# EasyEDA Pro project SKY13575-639LF射频开关1to4.eprj

# Schematic Schematic1
Board Name: Board1; Create Date: 2025-12-01; Page Name: P1; Project Name: SKY13575-639LF射频开关1to4; Schematic Name: Schematic1; Update Date: 2025-12-01; Company: 嘉立创EDA; Page Size: A4; Version: V1.0
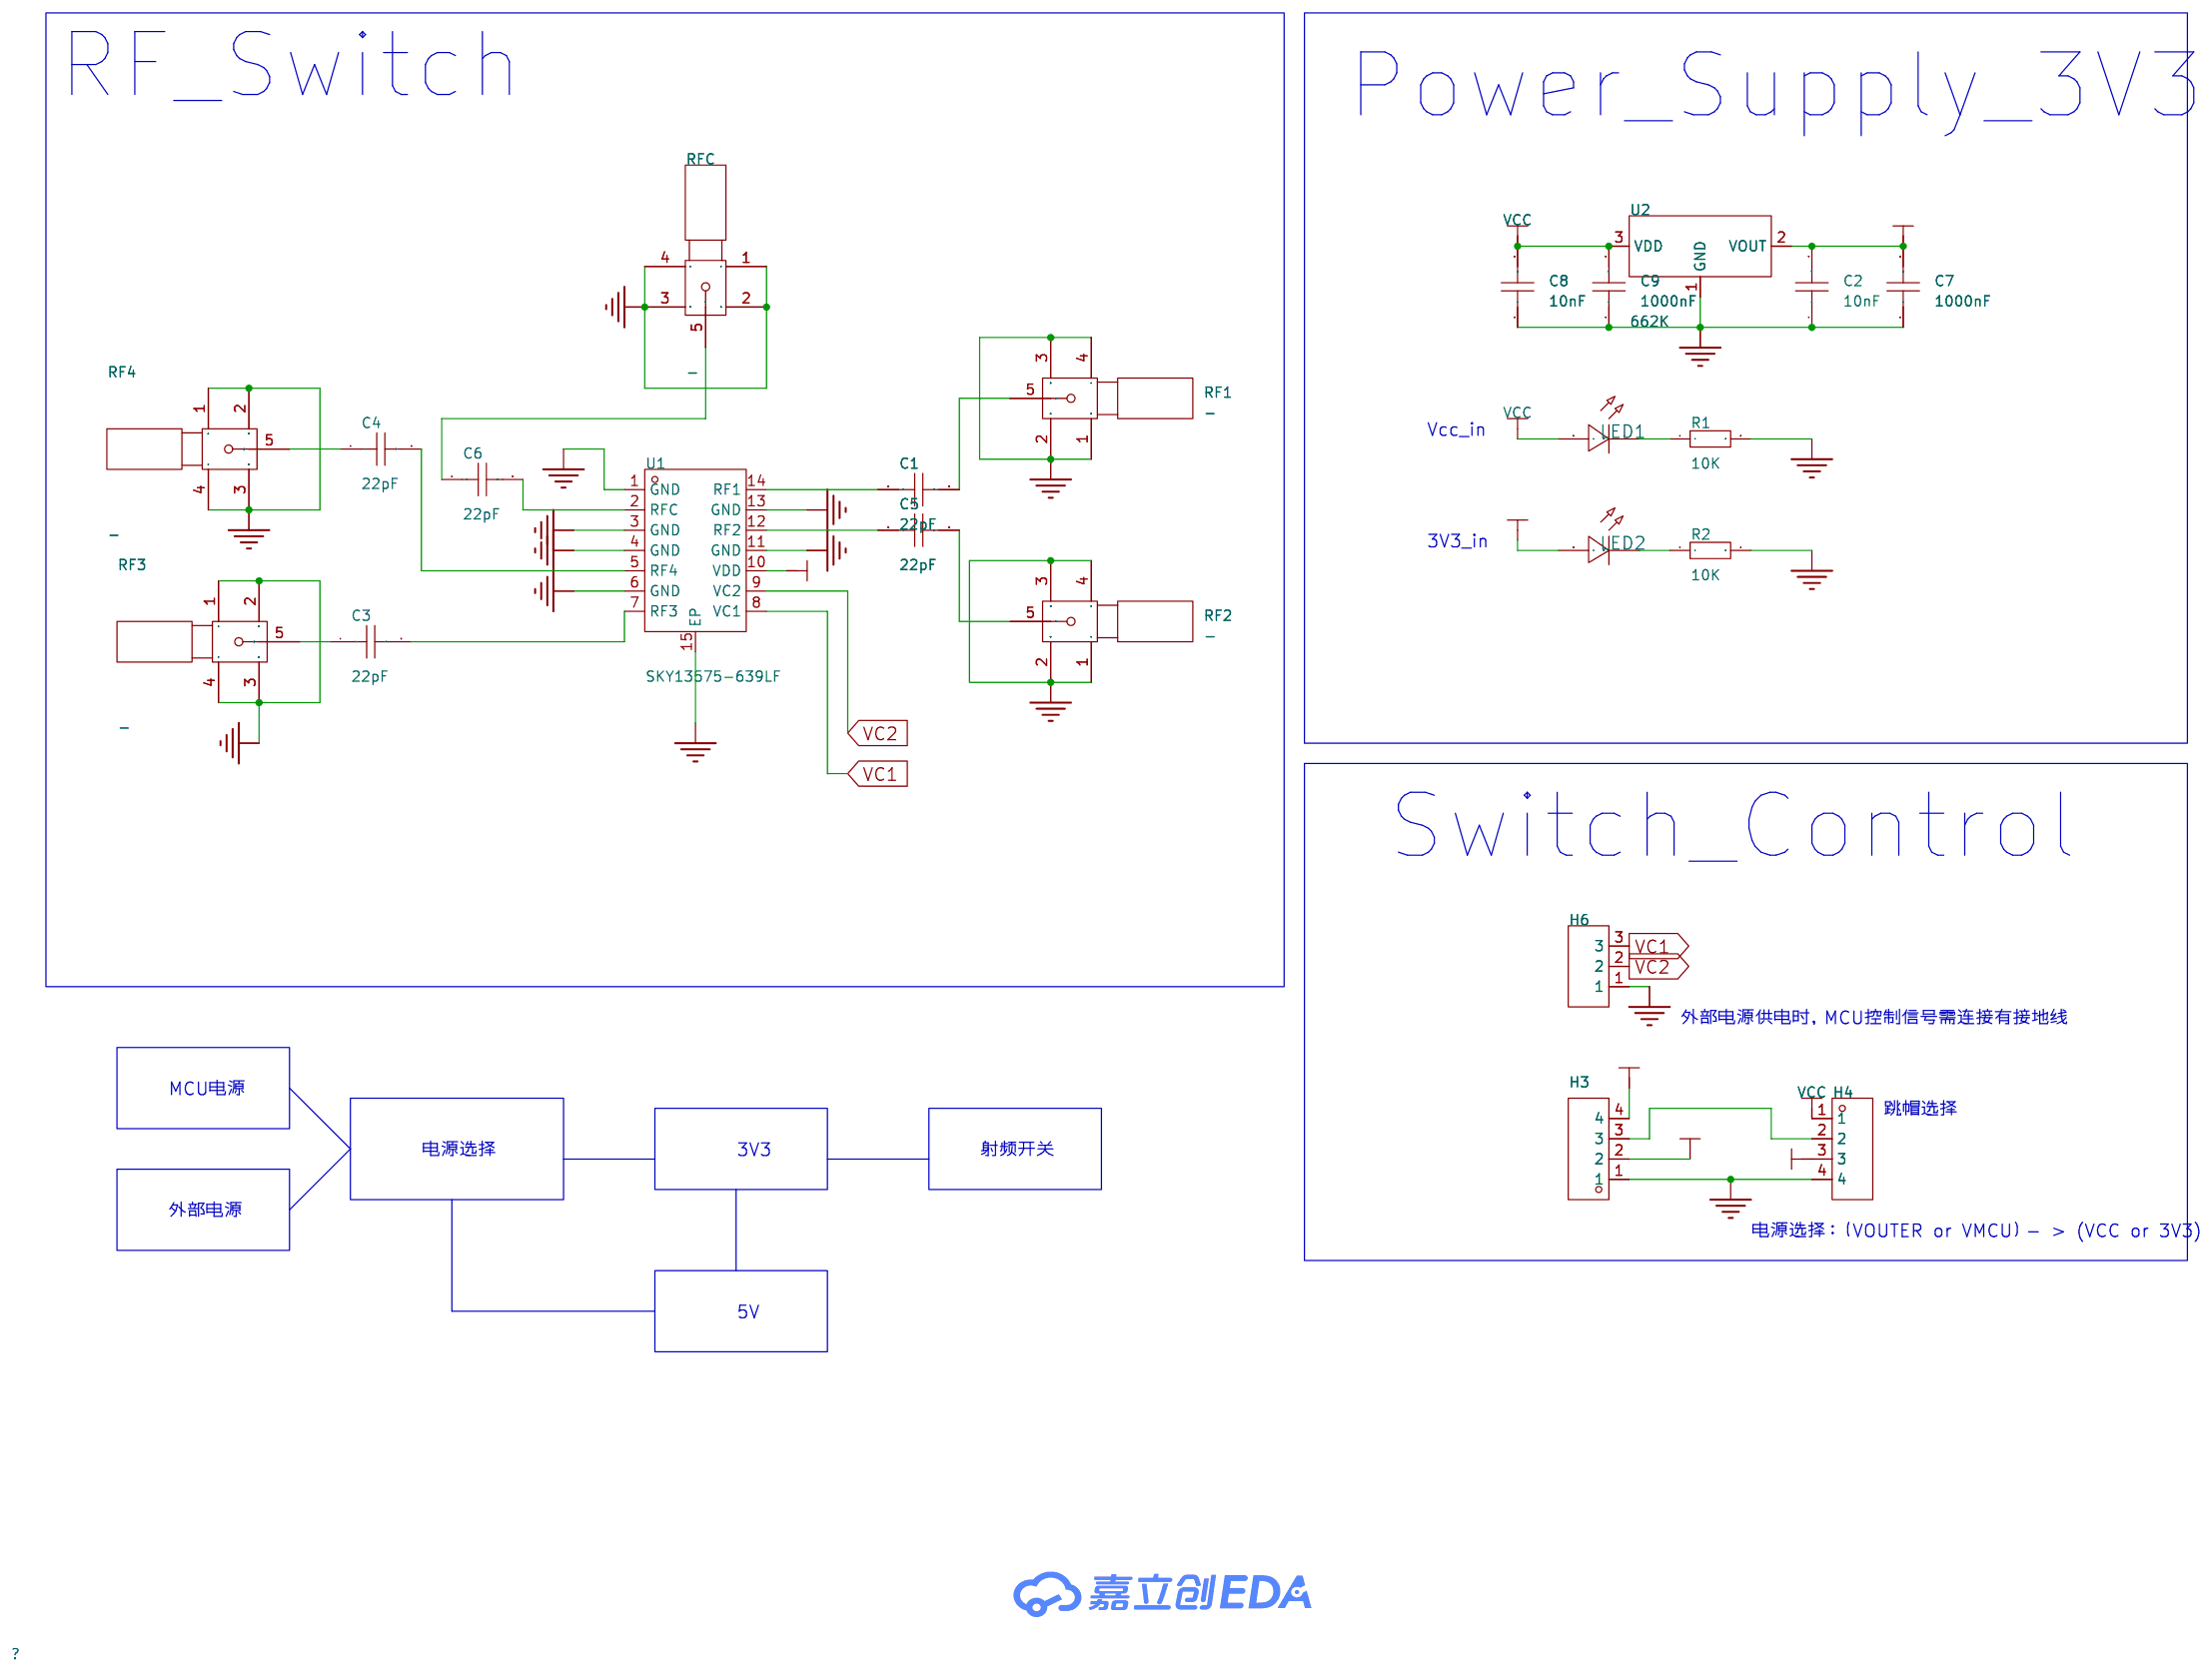
[diagram p0: schematic sheet]

## Parts
C1  22pF  [C0603]
C2  10nF  [C0603]
C3  22pF  [C0603]
C4  22pF  [C0603]
C5  22pF  [C0603]
C6  22pF  [C0603]
C7  1000nF  [C0603]
C8  10nF  [C0603]
C9  1000nF  [C0603]
H3  -  [HDR-TH_4P-P2.54-V-F]
H4  -  [HDR-TH_4P-P2.54-V-F]
H6  -  [HDR-TH_3P-P2.54-V-F]
LED1  -  [LED_0603]
LED2  -  [LED_0603]
R1  10K  [R0603]
R2  10K  [R0603]
RF1  -  [SMA-SMD_BWSMA-KE-P001]
RF2  -  [SMA-SMD_BWSMA-KE-P001]
RF3  -  [SMA-SMD_BWSMA-KE-P001]
RF4  -  [SMA-SMD_BWSMA-KE-P001]
RFC  -  [SMA-SMD_BWSMA-KE-P001]
U1  SKY13575-639LF  [QFN-14_L1.6-W1.6-P0.40-BL-EP0.7]
U2  662K  [SOT-23-3_L2.9-W1.3-P1.90-LS2.4-BR]

## Library data of the parts
C1-C9 = CAP_0603: Supplier Footprint: 0603
H3 H4 = HDR-F_2.54_1x4P: Supplier Part: C2718488; Supplier Footprint: 插件
H6 = HDR-F_2.54_1x3P: Supplier Part: C541850; Supplier Footprint: 插件
LED1 LED2 = LED_0603-R: Supplier Footprint: 0603
R1 R2 = Res_0603: Supplier Footprint: 0603
RF1-RF4 RFC = BWSMA-KE-P001: LCSC Part Name: 内孔 SMA 偏脚; Supplier Part: C496550; Manufacturer: BAT WIRELESS(蝙蝠无线); Supplier Footprint: SMD; JLCPCB Part Class: 扩展库; Datasheet: https://atta.szlcsc.com/upload/public/pdf/source/20240320/28FD502871C976DFF213ABFCF2A0ED51.pdf; Supplier: LCSC; Connector Type: 板端; Interface: 内孔; Number of Ports: 1; Interface Diameter: 5.2mm; RF Series: SMA; Impedance: 50Ω; Style: 偏脚
U1 = SKY13575-639LF: Supplier Part: C2654730; Manufacturer: SKYWORKS; Supplier Footprint: QFN-14-EP(1.6x1.6); JLCPCB Part Class: 扩展库; Datasheet: https://item.szlcsc.com/datasheet/SKY13575-639LF/2746639.html; Supplier: LCSC
U2 = 662K: LCSC Part Name: 662K. 输入8V 300mA; Supplier Part: C7470756; Manufacturer: HXY MOSFET(华轩阳电子); Supplier Footprint: SOT-23; JLCPCB Part Class: 扩展库; Datasheet: https://item.szlcsc.com/datasheet/662K/8523266.html; Supplier: LCSC; Output Type: 固定; Voltage - Supply: 8V; Output Voltage: 3.3V; Output Current: 300mA; Power Supply Rejection Ratio (PSRR): 40dB@(1kHz); Voltage Dropout: 160mV@(50mA); standby current: 3uA; Features: 过流保护; Operating Temperature: -40℃~+85℃; Output Configuration: 正极; Number of Outputs: 1

## Nets
3V3: C2.2 C7.2 H4.3 LED2.2(A) U1.10(VDD) U2.2(VOUT)
GND: C2.1 C7.1 C8.1 C9.1 H3.1 H4.4 H6.1 R1.2 R2.2 RF1.1 RF1.2 RF1.3 RF1.4 RF2.1 RF2.2 RF2.3 RF2.4 RF3.1 RF3.2 RF3.3 RF3.4 RF4.1 RF4.2 RF4.3 RF4.4 RFC.1 RFC.2 RFC.3 RFC.4 U1.1(GND) U1.3(GND) U1.4(GND) U1.6(GND) U1.11(GND) U1.13(GND) U1.15(EP) U2.1(GND)
VCC: C8.2 C9.2 H4.1 LED1.2(A) U2.3(VDD)
VC1: H6.3 U1.8(VC1)
VC2: H6.2 U1.9(VC2)
VMCU: H3.2
VOUTER: H3.4
$1N936: C4.1 RF4.5
$1N951: C5.2 RF2.5
$1N962: C4.2 U1.5(RF4)
$1N970: C6.2 U1.2(RFC)
$1N976: C1.1 U1.14(RF1)
$1N981: C5.1 U1.12(RF2)
$1N986: C3.1 RF3.5
$1N1095: C1.2 RF1.5
$1N2051: H3.3 H4.2
$1N2530: C3.2 U1.7(RF3)
$1N2570: C6.1 RFC.5
Net-(LED1-1): LED1.1(C) R1.1
Net-(LED2-1): LED2.1(C) R2.1

## Notes on the sheet
- RF_Switch
- Power_Supply_3V3
- Vcc_in
- 3V3_in
- Switch_Control
- 外部电源供电时，MCU控制信号需连接有接地线
- MCU电源
- 跳帽选择
- 电源选择
- 3V3
- 射频开关
- 外部电源
- 电源选择：（VOUTER or VMCU）- > (VCC or 3V3)
- 5V

# Board PCB1
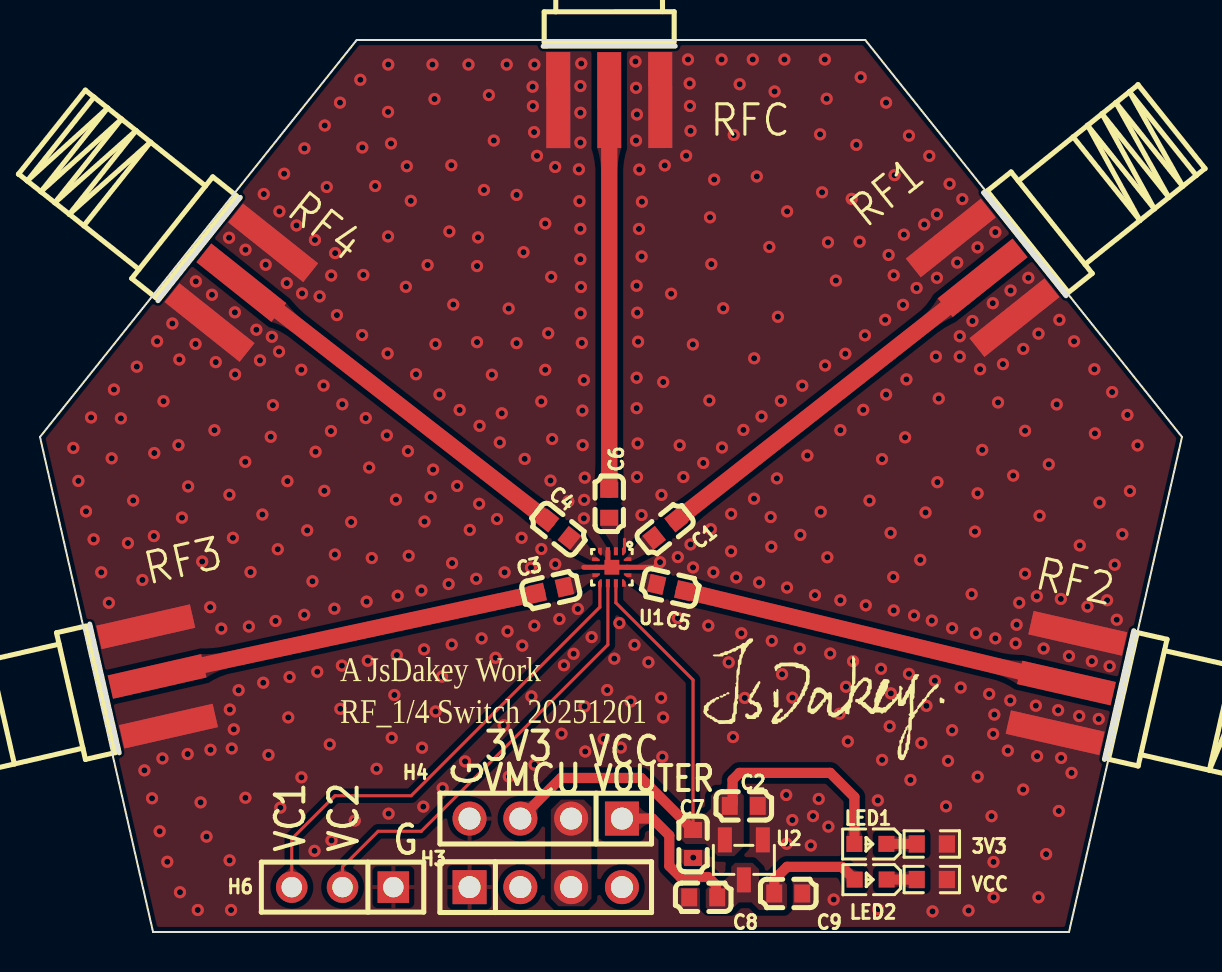
[diagram p1: board, top side]
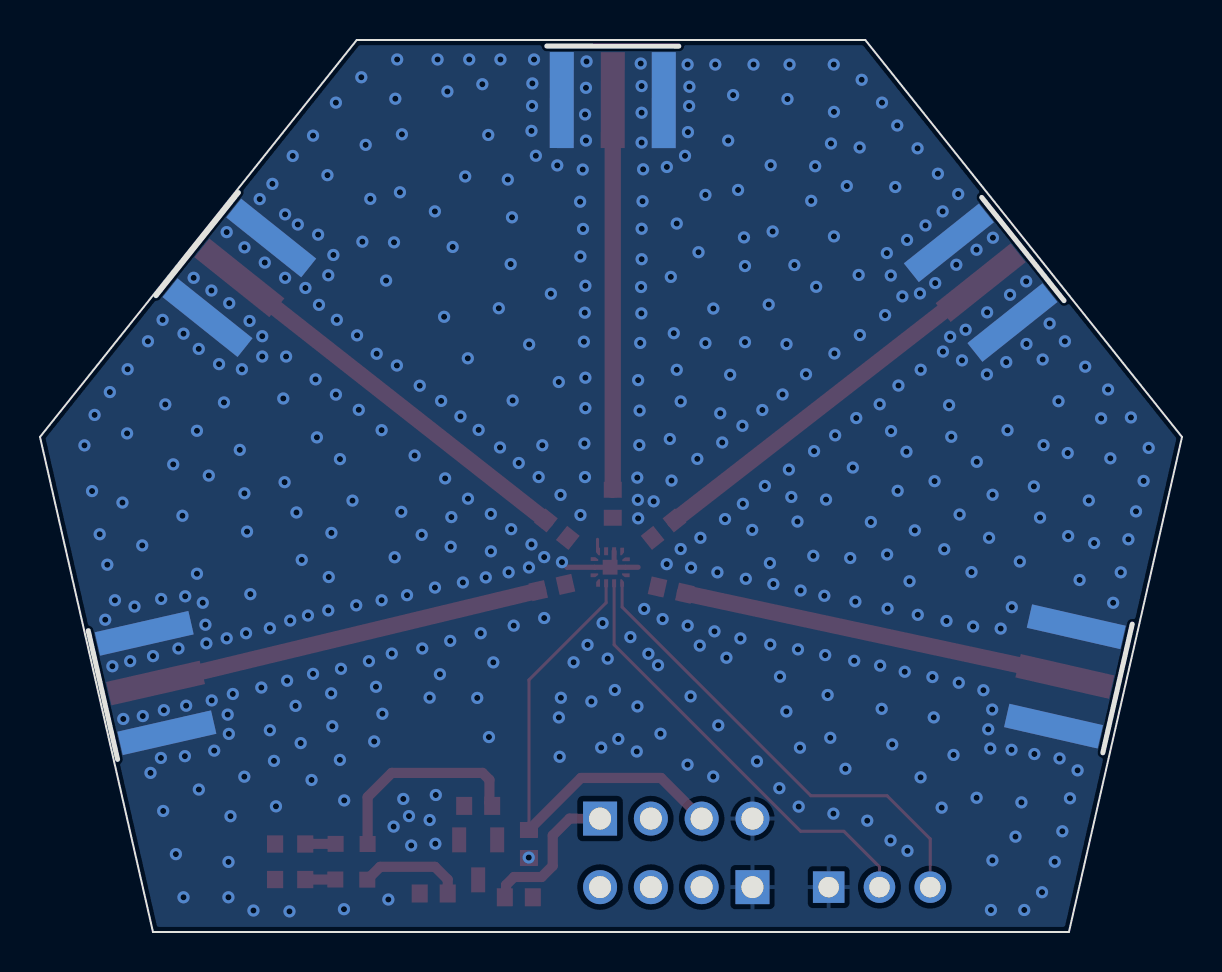
[diagram p2: board, bottom side, seen from below]

Outline 57.1 x 44.62 mm; copper layers: Top Layer, Bottom Layer. Coordinates in mm from the lower left corner of the outline.
Outline path: 0,24.76 5.65,0 51.45,0 57.1,24.76 41.26,44.62 15.84,44.62 0,24.76
Stack: Top Layer 0.035mm / Dielectric1 1.51mm FR4 er 4.5 / Bottom Layer 0.035mm

## Design rules (mm)
template: 自定义配置
spacing copperThickness1oz (default): track to track 0.102, other pairs 0.152 to 0.3
spacing copperThickness2oz: track to track 0.203, other pairs 0.152 to 0.3
track width copperThickness1oz (default): min 0.127, default 0.254, max 2.54
track width copperThickness2oz: min 0.203, default 0.254, max 2.54
differential pair differentialPair (default): width min 0.127, default 0.254, max 2.54; gap min 0.152, default 0.152
via viaSize (default): diameter min 0.5, default 0.61, max 10; hole min 0.3, default 0.305, max 6.3

## Placement (name value [footprint] x y rotation side)
3V3  10K  [R0603]  44.59 4.4 0 top
C1  22pF  [C0603]  31.26 20.15 38.6 top
C2  10nF  [C0603]  35.19 6.31 180 top
C3  22pF  [C0603]  25.54 17.1 12.9 top
C4  22pF  [C0603]  25.92 20.15 321.4 top
C5  22pF  [C0603]  31.51 17.23 347.1 top
C6  22pF  [C0603]  28.46 21.42 270 top
C7  1000nF  [C0603]  32.65 4.4 90 top
C8  10nF  [C0603]  33.16 1.74 0 top
C9  1000nF  [C0603]  37.41 1.93 180 top
H3  -  [HDR-TH_4P-P2.54-V-F]  25.29 2.25 0 top
H4  -  [HDR-TH_4P-P2.54-V-F]  25.29 5.67 180 top
H6  -  [HDR-TH_3P-P2.54-V-F]  15.13 2.25 180 top
LED1  -  [LED_0603]  41.48 2.62 180 top
LED2  -  [LED_0603]  41.47 4.4 180 top
RF1  -  [SMA-SMD_BWSMA-KE-P001]  47.13 32.73 38.6 top
RF2  -  [SMA-SMD_BWSMA-KE-P001]  51.32 12.45 347.2 top
RF3  -  [SMA-SMD_BWSMA-KE-P001]  5.86 12.79 192.9 top
RF4  -  [SMA-SMD_BWSMA-KE-P001]  10.07 32.48 141.4 top
RFC  -  [SMA-SMD_BWSMA-KE-P001]  28.46 41.62 90 top
U1  SKY13575-639LF  [QFN-14_L1.6-W1.6-P0.40-BL-EP0.7]  28.59 18.25 180 top
U2  662K  [SOT-23-3_L2.9-W1.3-P1.90-LS2.4-BR]  35.19 3.61 90 top
VCC  10K  [R0603]  44.59 2.63 0 top

## Footprints (pads in the part's own frame, mm; a bottom-side part is the same pattern mirrored in y, then rotated)
C0603
  rect 0.8x0.9 smd: 1(-0.7,0) 2(0.7,0)
HDR-TH_3P-P2.54-V-F
  rect 1.575x1.575 hole 1.02: 1(-2.54,0)
  round 1.575 hole 1.02: 2(0,0) 3(2.54,0)
HDR-TH_4P-P2.54-V-F
  rect 1.7x1.7 hole 1.1: 1(-3.81,0)
  round 1.7 hole 1.1: 2(-1.27,0) 3(1.27,0) 4(3.81,0)
LED_0603
  rect 0.8x0.8 smd: 1(-0.851,-0.01) 2(0.75,-0.005)
QFN-14_L1.6-W1.6-P0.40-BL-EP0.7
  custom 0.192x0.376 smd: 1(-0.606,-0.788) 4(0.596,-0.788) 8(0.596,0.788) 11(-0.606,0.788)
  rect 0.2x0.4 smd: 2(-0.205,-0.8) 3(0.195,-0.8) 9(0.195,0.8) 10(-0.205,0.8)
  custom 0.376x0.192 smd: 5(0.792,-0.4) 7(0.782,0.4) 12(-0.792,0.401) 14(-0.788,-0.408)
  rect 0.4x0.2 smd: 6(0.767,0) 13(-0.777,0)
  rect 0.74x0.74 smd: 15(-0.005,0)
R0603
  rect 0.806x0.864 smd: 1(-0.753,0) 2(0.753,0)
SMA-SMD_BWSMA-KE-P001
  rect 4.8x1.2 smd: 1(0,-2.55) 2(0,2.55) 5(0,0)
  rect 4.8x1.2 smd far side: 3(0,2.55) 4(0,-2.55)
SOT-23-3_L2.9-W1.3-P1.90-LS2.4-BR
  rect 1.25x0.7 smd: 1(1,-0.95) 2(1,0.95) 3(-1,0)

## Nets
As in the schematic, except:
GND: 3V3.2 C2.1 C7.1 C8.1 C9.1 H3.1 H4.4 H6.1 RF1.1 RF1.2 RF1.3 RF1.4 RF2.1 RF2.2 RF2.3 RF2.4 RF3.1 RF3.2 RF3.3 RF3.4 RF4.1 RF4.2 RF4.3 RF4.4 RFC.1 RFC.2 RFC.3 RFC.4 U1.1 U1.3 U1.4 U1.6 U1.11 U1.13 U1.15 U2.1 VCC.2
$1N1695: LED1.1 VCC.1
$1N1711: 3V3.1 LED2.1

## Via types
v1: diameter 0.61, hole 0.305, Top Layer to Bottom Layer, 476 vias

## Routing (per net, layer and track width the routed paths; a pad name or vN(x,y) marks a point on that pad's centre or on a via; arc(x,y) is an arc through that point)
3V3: length 34.9
  Top Layer w0.152: C7.2 32.65,12.61 28.79,16.47 U1.10
  Top Layer w0.508: H4.3 26.05,7.71 30.05,7.71 C7.2 ; C2.2 34.63,6.45 34.63,7.61 34.98,7.96 39.51,7.96 40.72,6.75 LED2.2
GND: length 5.4
  Top Layer w0.152: U1.1 29.22,19.06 29.22,19.64
  Top Layer w0.254: U1.15 28.39,18.45 U1.3 ; U1.15 U1.6 27.19,18.25 ; U1.15 U1.13 30.75,18.25 v1(31,18.5)
  vias: v1(1.67,24.22) v1(1.92,22.57) v1(2.3,21.04) v1(2.55,25.74) v1(2.68,19.64) v1(3.06,17.99) v1(3.44,16.47) v1(3.58,23.7) v1(3.7,27.14) v1(4.05,25.7) v1(4.4,19.46) v1(4.66,21.59) v1(4.84,28.28) v1(5.12,17.61) v1(5.22,8.09) v1(5.6,6.69) v1(5.71,23.96) v1(5.69,19.81) v1(5.86,29.55) v1(5.98,5.04) v1(6.18,26.55) v1(6.12,8.68) v1(6.36,3.52) v1(6.62,30.44) v1(6.97,28.64) v1(6.92,24.36) v1(7,1.99) v1(7.1,20.73) v1(7.41,22.29) v1(7.38,8.9) v1(7.78,29.42) v1(7.79,32.55) v1(7.89,1.1) v1(8.03,6.49) v1(8.11,18.53) v1(8.33,4.77) v1(8.51,16.25) v1(8.52,9.12) v1(8.6,31.88) v1(8.72,25.1) v1(8.79,28.51) v1(9.07,15.18) v1(9.45,34.73) v1(9.47,21.87) v1(9.49,11.13) v1(9.48,3.59) v1(9.55,1.1) v1(9.65,19.72) v1(9.59,9.18) v1(9.74,31) v1(9.76,27.89) v1(9.69,10.14) v1(9.93,12.1) v1(10.27,34.13) v1(10.26,23.52) v1(10.27,6.72) v1(10.44,15.28) v1(10.53,18.01) v1(10.82,30.13) v1(11,28.6) v1(11.12,20.88) v1(11.16,12.47) v1(11.19,36.92) v1(11.29,33.38) v1(11.42,8.86) v1(11.54,24.77) v1(11.59,29.77) v1(11.65,26.35) v1(11.78,15.56) v1(11.97,36.05) v1(11.95,29.04) v1(11.89,19.15) v1(12.02,6.22) v1(12.21,37.93) v1(12.34,32.46) v1(12.37,22.55) v1(12.41,10.74) v1(12.48,12.76) v1(12.83,35.35) v1(13.07,28.13) v1(13.07,7.74) v1(13.1,31.94) v1(13.22,39.2) v1(13.21,15.87) v1(13.36,20.09) v1(13.62,17.54) v1(13.75,34.62) v1(13.78,24.03) v1(13.73,4.06) v1(13.86,13.02) v1(13.98,31.8) v1(14.18,27.34) v1(14.24,40.35) v1(14.22,22.07) v1(14.34,37.27) v1(14.56,32.84) v1(14.55,25.06) v1(14.49,9.39) v1(14.57,4.58) v1(14.76,33.96) v1(14.74,18.88) v1(14.72,16.18) v1(14.85,30.86) v1(15,41.49) v1(15.02,11.16) v1(15.12,26.4) v1(15.09,13.33) v1(15.56,20.51) v1(15.74,5.57) v1(16.02,42.63) v1(16.12,39.25) v1(16.17,32.87) v1(16.11,29.86) v1(16.29,25.71) v1(16.33,16.53) v1(16.46,23.23) v1(16.39,13.57) v1(16.59,18.71) v1(16.76,37.32) v1(16.83,8.17) v1(17.34,24.85) v1(17.41,43.39) v1(17.4,41.03) v1(17.4,34.8) v1(17.38,28.94) v1(17.43,5.92) v1(17.55,39.44) v1(17.59,9.71) v1(17.72,11.86) v1(17.8,21.63) v1(17.84,13.85) v1(17.88,16.82) v1(18.34,38.31) v1(18.29,32.28) v1(18.4,24.06) v1(18.44,18.82) v1(18.54,36.58) v1(18.8,27.9) v1(19.07,17.08) v1(19.1,9.22) v1(19.17,6.27) v1(19.23,20.53) v1(19.2,14.14) v1(19.38,33.36) v1(19.53,21.76) v1(19.62,43.39) v1(19.66,23.13) v1(19.73,41.67) v1(19.78,29.41) v1(19.78,11.03) v1(19.97,26.89) v1(20.1,12.77) v1(20.13,7.2) v1(20.47,35.04) v1(20.43,17.41) v1(20.57,38.36) v1(20.67,31.39) v1(20.61,18.46) v1(20.59,14.38) v1(20.86,22.31) v1(20.98,26.11) v1(21.25,8.54) v1(21.42,43.39) v1(21.49,20.12) v1(21.85,33.31) v1(21.85,29.51) v1(21.81,17.67) v1(21.9,34.75) v1(21.96,21.42) v1(21.98,25.32) v1(22.08,14.69) v1(22.2,37.12) v1(22.45,41.87) v1(22.59,27.88) v1(22.69,39.59) v1(22.85,20.66) v1(22.78,13.72) v1(22.99,24.49) v1(23.09,25.95) v1(23.23,17.99) v1(23.19,10.34) v1(23.34,43.39) v1(23.38,15.04) v1(23.43,31.19) v1(23.44,7.78) v1(23.83,36.87) v1(23.83,29.46) v1(24.18,34.01) v1(24.08,19.72) v1(24.11,14.33) v1(24.23,23.67) v1(24.55,18.23) v1(24.57,11.79) v1(24.63,42.28) v1(24.64,41.32) v1(24.72,43.39) v1(24.7,40.01) v1(24.72,15.33) v1(24.72,8.37) v1(24.85,38.83) v1(25.07,26.54) v1(25.07,19.16) v1(25.26,35.44) v1(25.26,28.12) v1(25.41,29.95) v1(25.56,32.77) v1(25.52,22.58) v1(25.61,24.66) v1(25.76,38.27) v1(25.76,18.4) v1(25.97,15.66) v1(26.08,9.92) v1(26.2,13.35) v1(26.42,21.54) v1(26.68,13.92) v1(26.95,38.15) v1(26.97,36.56) v1(26.89,16.16) v1(27.06,43.45) v1(27.02,42.32) v1(27.02,40.98) v1(27.02,39.49) v1(27.02,35.18) v1(27.02,33.66) v1(27.05,32.27) v1(27.03,30.95) v1(27.09,29.47) v1(27.12,26.08) v1(27.14,24.36) v1(27.19,27.61) v1(27.24,22.73) v1(27.21,21.62) v1(27.19,20.69) v1(27.23,11.28) v1(27.26,9.03) v1(27.58,14.75) v1(28.18,9.66) v1(28.36,12.1) v1(28.72,13.68) v1(28.97,15.45) v1(29.04,9.23) v1(29.53,11.53) v1(29.77,43.55) v1(29.72,14.36) v1(29.8,42.23) v1(29.85,40.9) v1(29.8,39.59) v1(29.83,32.33) v1(29.86,30.98) v1(29.83,27.73) v1(29.83,26.21) v1(29.85,22.76) v1(29.96,38.14) v1(29.95,35.17) v1(29.91,29.53) v1(29.88,24.44) v1(30.08,20.86) v1(30.1,36.53) v1(30.08,33.79) v1(30.42,13.49) v1(31.07,21.87) v1(31.06,11.72) v1(31.16,27.51) v1(31.16,10.73) v1(31.12,8.77) v1(31.24,38.35) v1(31.56,31.93) v1(31.89,18.76) v1(31.89,15.71) v1(31.98,24.35) v1(32.17,22.76) v1(32.31,38.83) v1(32.4,43.65) v1(32.48,42.45) v1(32.5,41.32) v1(32.53,40.08) v1(32.53,19.39) v1(32.64,29.39) v1(32.65,18.24) v1(32.66,3.73) v1(33.16,23.46) v1(33.47,26.59) v1(33.42,15.33) v1(33.5,35.75) v1(33.57,33.41) v1(33.54,20.15) v1(33.67,17.99) v1(33.71,37.64) v1(34.08,43.65) v1(34.16,31.2) v1(34.1,24.24) v1(34.44,13.49) v1(34.56,20.91) v1(34.56,19.04) v1(34.65,9.75) v1(34.69,39.87) v1(34.81,17.74) v1(34.98,42.41) v1(35.07,14.95) v1(35.17,25.12) v1(35.24,11.71) v1(35.64,43.65) v1(35.71,28.7) v1(35.7,21.68) v1(35.84,37.79) v1(35.96,17.49) v1(36.08,25.79) v1(36.47,34.27) v1(36.53,20.76) v1(36.57,19.27) v1(36.59,14.56) v1(36.73,42.05) v1(36.84,22.69) v1(36.9,30.78) v1(37.04,26.57) v1(37.11,12.9) v1(37.22,43.65) v1(37.36,36.05) v1(37.35,17.23) v1(37.31,6.86) v1(37.33,4.42) v1(37.62,11.72) v1(37.62,5.6) v1(38.02,19.87) v1(37.99,14.18) v1(38.11,27.33) v1(38.37,23.84) v1(38.54,4.33) v1(38.65,5.8) v1(38.75,16.85) v1(38.94,6.66) v1(39,39.9) v1(39.04,21.02) v1(39.1,37) v1(39.24,43.65) v1(39.26,28.34) v1(39.33,41.68) v1(39.37,18.75) v1(39.4,34.5) v1(39.42,5.27) v1(39.51,13.93) v1(39.68,1.63) v1(39.8,32.59) v1(40.02,25.11) v1(40.02,16.6) v1(39.98,10.92) v1(40.27,28.93) v1(40.3,12.27) v1(40.39,9.53) v1(40.59,36.67) v1(40.65,13.55) v1(40.82,39.38) v1(41.04,42.76) v1(40.98,34.53) v1(41.16,26.12) v1(41.25,29.85) v1(41.29,16.34) v1(41.48,21.58) v1(41.89,6.58) v1(41.9,1.14) v1(42.05,13.17) v1(42.1,23.66) v1(42.11,8.61) v1(42.26,30.62) v1(42.31,41.49) v1(42.31,26.88) v1(42.43,33.87) v1(42.53,19.97) v1(42.54,11.94) v1(42.48,10.29) v1(42.66,17.76) v1(42.73,37.86) v1(42.69,32.85) v1(42.69,16.09) v1(43.15,31.37) v1(43.19,34.88) v1(43.26,24.74) v1(43.32,27.65) v1(43.45,39.84) v1(43.45,12.91) v1(43.52,7.61) v1(43.7,15.83) v1(43.83,32.22) v1(44.01,18.61) v1(44.07,9.45) v1(44.21,35.39) v1(44.28,20.99) v1(44.32,11.31) v1(44.46,38.82) v1(44.59,15.58) v1(44.63,1.03) v1(44.74,12.57) v1(44.85,35.9) v1(44.85,32.73) v1(44.8,28.79) v1(44.87,22.5) v1(44.94,26.69) v1(45.3,6.29) v1(45.4,8.56) v1(45.48,37.42) v1(45.61,15.2) v1(45.61,10.09) v1(45.86,33.49) v1(45.99,29.8) v1(45.99,28.79) v1(46.03,12.23) v1(46.12,36.66) v1(46.43,1.08) v1(46.62,30.57) v1(46.58,16.9) v1(46.75,20.03) v1(46.88,34.25) v1(46.8,14.95) v1(46.88,21.94) v1(46.88,7.77) v1(47,28.15) v1(47.11,24.12) v1(47.46,11.91) v1(47.58,5.79) v1(47.64,31.46) v1(47.66,9.91) v1(47.68,3.51) v1(47.77,35.01) v1(47.77,14.69) v1(47.72,10.88) v1(47.68,1.74) v1(47.9,26.49) v1(48.15,28.41) v1(48.39,9.07) v1(48.53,32.09) v1(48.51,11.59) v1(48.66,22.83) v1(48.83,15.37) v1(48.78,14.44) v1(48.96,16.47) v1(49.16,29.17) v1(49.16,7.13) v1(49.25,25.07) v1(49.25,17.92) v1(49.42,32.73) v1(49.84,16.79) v1(49.79,11.32) v1(49.86,8.8) v1(49.93,29.93) v1(49.93,1.74) v1(49.98,20.82) v1(50.18,14.18) v1(50.31,3.9) v1(50.44,23.39) v1(50.84,26.39) v1(50.97,30.62) v1(50.91,11.1) v1(50.94,6.06) v1(51.04,16.66) v1(51.06,8.71) v1(51.45,13.8) v1(51.58,7.96) v1(51.7,29.55) v1(51.96,10.8) v1(51.99,19.34) v1(52.37,16.28) v1(52.59,13.55) v1(52.72,28.15) v1(52.75,24.94) v1(52.98,21.48) v1(52.94,10.66) v1(53.35,16.6) v1(53.48,13.29) v1(53.61,27.01) v1(53.74,18.37) v1(53.84,15.62) v1(54.12,19.9) v1(54.37,25.87) v1(54.5,22.06) v1(54.88,24.34)
VCC: length 12.9
  Top Layer w0.508: C9.2 36.71,2.62 37.35,3.26 40.09,3.26 LED1.2 ; C8.2 33.8,1.8 33.8,2.35 33.4,2.75 32.02,2.75 31.46,3.31 31.46,4.83 30.62,5.67 H4.1
VC1: length 23.8
  Top Layer w0.152: U1.8 27.99,16.25 18.56,6.82 14.75,6.82 12.59,4.66 H6.3
VC2: length 22
  Top Layer w0.152: H6.2 15.13,3.26 16.91,5.04 19.06,5.04 28.39,14.37 U1.9
$1N936: length 19.4
  Top Layer w0.815: C4.1 10.09,32.48
$1N951: length 19.4
  Top Layer w0.815: C5.2 51.02,12.54
$1N986: length 19.4
  Top Layer w0.815: C3.1 5.93,12.87
$1N1095: length 19.4
  Top Layer w0.816: C1.2 47.03,32.56
$1N1695: length 1.5
  Top Layer w0.508: LED1.1 43.84,2.63
$1N1711: length 1.5
  Top Layer w0.508: LED2.1 43.83,4.41 3V3.1
$1N2570: length 19.4
  Top Layer w0.815: C6.1 28.46,41.49

## Copper pours and planes (outline as drawn; the poured copper is in the pictures)
3V3 on Top Layer: 32.02,7.07 35.19,7.07 35.19,3.8 32.02,3.8
GND on Top Layer: -10.15,55.08 67.32,55.08 67.32,-4.1 -10.15,-4.1
GND on Bottom Layer: -11.42,57.24 69.48,57.24 69.48,-6.01 -11.42,-6.01
VCC on Top Layer: 33.29,3.46 37.35,3.46 37.35,1.1 33.29,1.1
$1N962 on Top Layer: 26.39,19.82 27.84,19.82 27.84,18.55 26.39,18.55
$1N970 on Top Layer: 28.01,20.79 28.91,20.79 28.91,19.25 28.01,19.25
$1N976 on Top Layer: 29.33,19.82 30.83,19.82 30.83,18.56 29.33,18.56
$1N981 on Top Layer: 29.33,17.94 30.68,17.94 30.68,17.04 29.33,17.04
$1N2051 on Top Layer: 25.54,6.62 27.57,6.62 27.57,1.29 25.54,1.29
$1N2530 on Top Layer: 26.08,17.94 27.85,17.94 27.85,16.91 26.08,16.91

Small or netless copper shapes (teardrops, artwork), in the pictures only: 28 on Top Layer

## Text on the board
Top Silkscreen Layer: VOUTER | VMCU | 3V3 | VCC | G | VC1 | VC2 | A JsDakey Work / RF_1/4 Switch 20251201
